# EAGLE schematic pcb (EAGLE 9.1.3)
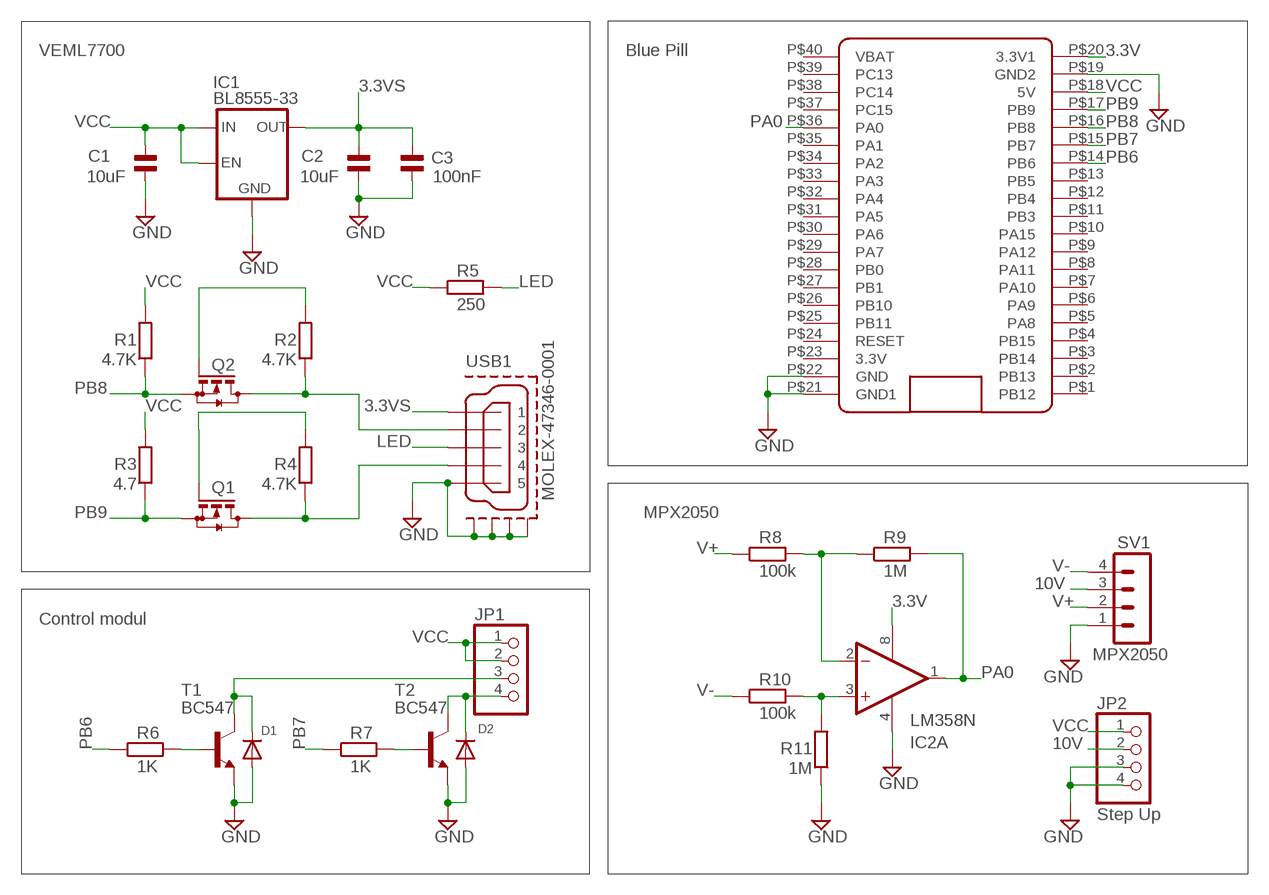
[diagram p0: schematic, sheet 1]

## Parts
C1  10uF  C-NP-SMD-0805  [C-0805]
C2  10uF  C-NP-SMD-0805  [C-0805]
C3  100nF  C-NP-SMD-0805  [C-0805]
D1  DIODESOD-123  [SOD-123]
D2  DIODESOD-123  [SOD-123]
IC1  BL8555-33  TPS70928DBV  [SOT23-5]
IC2  LM358N  [DIL08]
JP1  PINHD-1X4  [1X04]
JP2  Step Up  PINHD-1X4  [1X04]
Q1  BSS123  [SOT23]
Q2  BSS123  [SOT23]
R1  4.7K  R-EU_M0805  [M0805]
R2  4.7K  R-EU_M0805  [M0805]
R3  4.7  R-EU_M0805  [M0805]
R4  4.7K  R-EU_M0805  [M0805]
R5  250  R-EU_0204/7  [0204/7]
R6  1K  R-EU_0204/7  [0204/7]
R7  1K  R-EU_0204/7  [0204/7]
R8  100k  R-EU_0204/7  [0204/7]
R9  1M  R-EU_0204/7  [0204/7]
R10  100k  R-EU_0204/7  [0204/7]
R11  1M  R-EU_0204/7  [0204/7]
SV1  MPX2050  MA04-1  [MA04-1]
T1  BC547  [TO92]
T2  BC547  [TO92]
U$1  stm32f103c8t6  BLUE_PILL  [BLUE_PILL]
USB1  MOLEX-47346-0001  [MOLEX-47364-0001]

## Nets
3.3V: IC2.8(P:V+) U$1.P$20(3.3V1)
3.3VS: C2.2 C3.2 IC1.5(OUT) USB1.1
10V: JP2.2 SV1.3
GND: C1.1 C2.1 C3.1 D1.A D2.A IC1.2(GND) IC2.4(P:V-) JP2.3 JP2.4 R11.1 SV1.1 T1.1(E) T2.1(E) U$1.P$19(GND2) U$1.P$21(GND1) U$1.P$22(GND) USB1.5 USB1.GND1 USB1.GND2 USB1.GND3 USB1.GND4
LED: R5.2 USB1.3
N$1: D2.C JP1.4 T2.3(C)
N$2: Q1.1(G) R4.2
N$3: D1.C JP1.3 T1.3(C)
N$4: R7.2 T2.2(B)
N$5: Q2.1(G) R2.2
N$6: R6.2 T1.2(B)
N$7: Q2.3(D) R2.1 USB1.2
N$9: IC2.2(A:-IN) R8.2 R9.1
N$10: IC2.3(A:+IN) R10.2 R11.2
PA0: IC2.1(A:OUT) R9.2 U$1.P$36(PA0)
PB6: R6.1 U$1.P$14(PB6)
PB7: R7.1 U$1.P$15(PB7)
PB8: Q2.2(S) R1.1 U$1.P$16(PB8)
PB9: Q1.2(S) R3.1 U$1.P$17(PB9)
SDA: Q1.3(D) R4.1 USB1.4
V+: R8.1 SV1.2
V-: R10.1 SV1.4
VCC: C1.2 IC1.1(IN) IC1.3(EN) JP1.1 JP1.2 JP2.1 R1.2 R3.2 R5.1 U$1.P$18(5V)
Unconnected: IC2.5(B:+IN) IC2.6(B:-IN) IC2.7(B:OUT) U$1.P$1(PB12) U$1.P$2(PB13) U$1.P$3(PB14) U$1.P$4(PB15) U$1.P$5(PA8) U$1.P$6(PA9) U$1.P$7(PA10) U$1.P$8(PA11) U$1.P$9(PA12) U$1.P$10(PA15) U$1.P$11(PB3) U$1.P$12(PB4) U$1.P$13(PB5) U$1.P$23(3.3V) U$1.P$24(RESET) U$1.P$25(PB11) U$1.P$26(PB10) U$1.P$27(PB1) U$1.P$28(PB0) U$1.P$29(PA7) U$1.P$30(PA6) U$1.P$31(PA5) U$1.P$32(PA4) U$1.P$33(PA3) U$1.P$34(PA2) U$1.P$35(PA1) U$1.P$37(PC15) U$1.P$38(PC14) U$1.P$39(PC13) U$1.P$40(VBAT)

## Notes on the sheet
- VEML7700 | Blue Pill
- MPX2050
- Control modul

## Library data of the parts
C1-C3 = cap-pan40:C-NP: NON-POLARIZED FILM/CHIP
D1 D2 = adafruit:DIODE: Diode SMADIODE - SMA Surface Mount Package 20V 1A Schottky Diode Digikey: 641-1014-6-ND DO-1N4148 - Through Hole Small Current Diode SOD-123 20V 1 A (.5mV Vf) Schottky Diode - Digikey: MBRX120TPMSCT-ND SOD-323 10V 570mA (.38mV Vf, 3ns) Schottky Diode - Digikey: ZLLS410CT-ND SOD-523 30V 30mA Schottky Diode (RB751S-40TE61) - Digikey: RB751S-40TE61CT-ND SOT23-R/W - SOT23 Package (R = Solder Paste/Reflow Ovens, W = Hand-Soldering) BAT54Film 40V 300mA - Digikey: 497-7162-1-ND
IC1 = tps709xx_10:TPS709*: TPS709xx 150-mA, 30-V, 1-μA IQ Voltage Regulators with Enable Source: http://www.ti.com/lit/ds/symlink/tps709.pdf; MF: Texas Instruments; MPN: TPS70928DBVT; OC_FARNELL: 2314373; OC_NEWARK: 69W6897
IC2 = linear:LM358: OP AMP also LM158; LM258; LM2904 Source: http://cache.national.com/ds/LM/LM158.pdf
JP1 JP2 = pinhead:PINHD-1X4: PIN HEADER
Q1 Q2 = transistor-small-signal:BSS123: N-CHANNEL MOS FET
R1-R4 = resistor:R-EU_: RESISTOR, European symbol
R5-R11 = rcl:R-EU_: RESISTOR, European symbol; SPICEPREFIX: R
SV1 = con-lstb:MA04-1: PIN HEADER; OC_FARNELL: unknown; OC_NEWARK: unknown
T1 T2 = transistor-neu-to92:BC547: NPN TRANSISTOR
U$1 = BluePill:BLUE_PILL
USB1 = usb_con-update:MOLEX-47346-0001: MICRO USB B, BOTTOM MOUNT